# Altium project ESP_project.PrjPcb
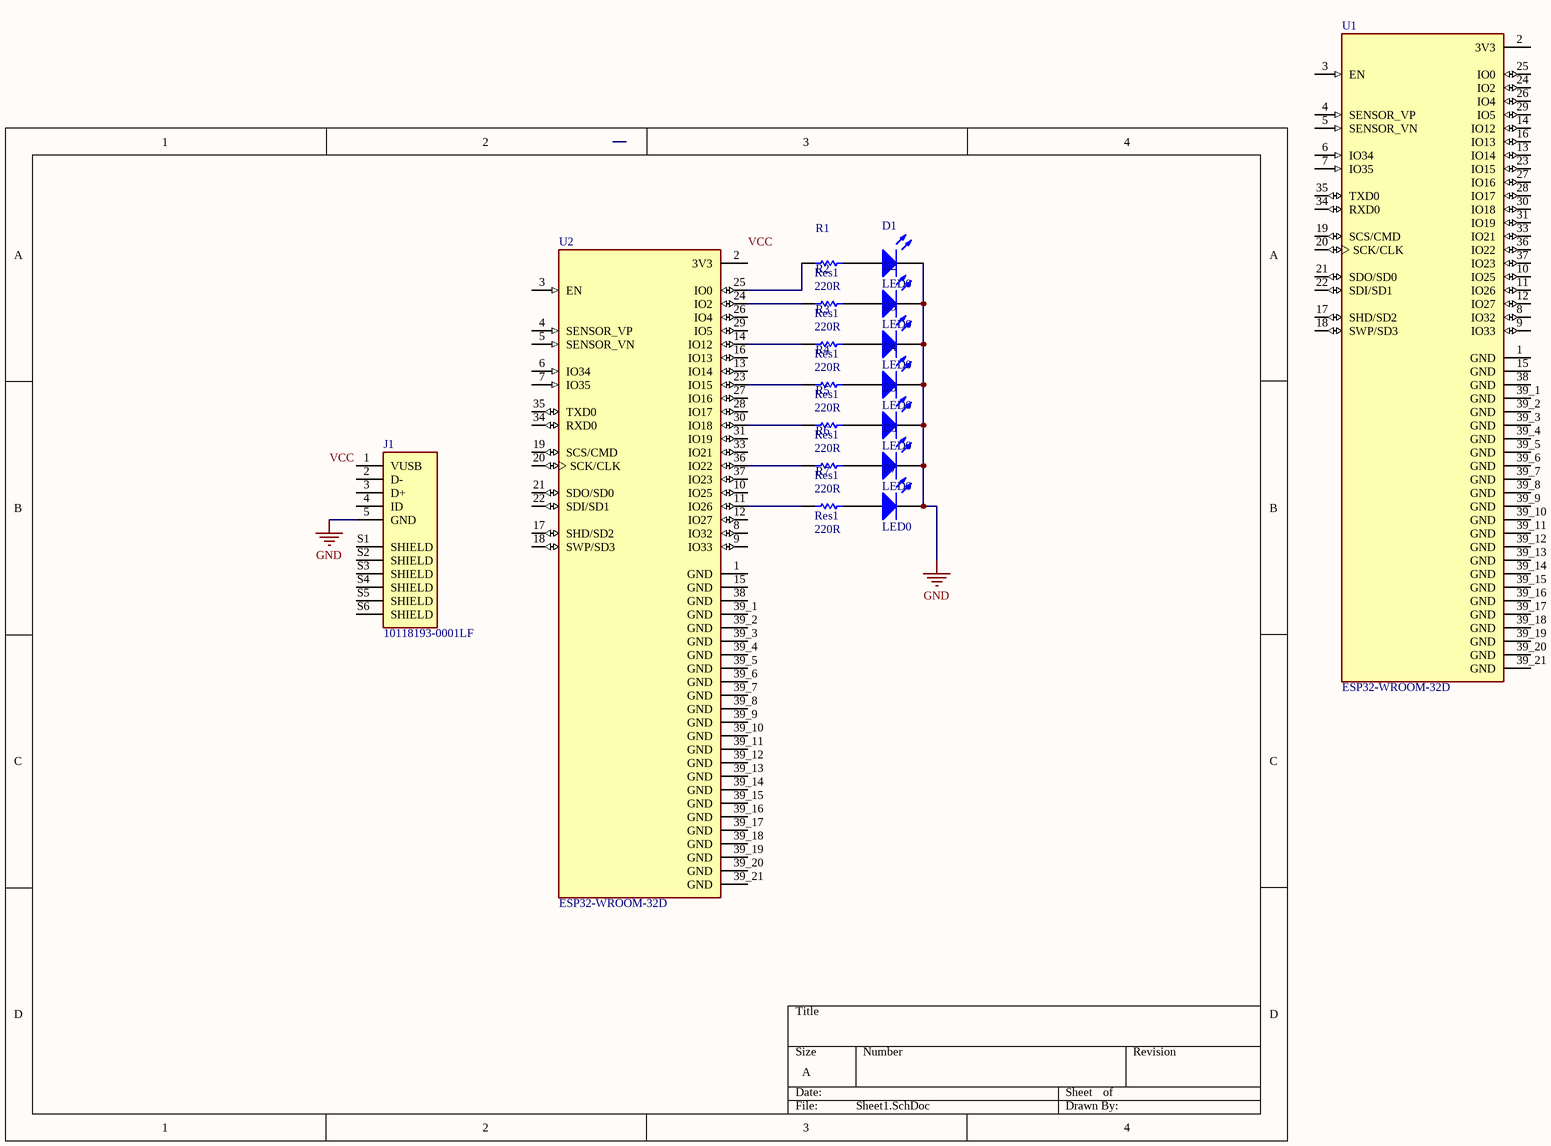
[diagram p0: Sheet1.SchDoc]
1 sheet, 17 parts. Net scope: global (net labels, ports and power ports of the same name join across sheets).
Board file: PCB1.PcbDoc

## Sheet Sheet1.SchDoc
size A; SheetNumber: 1; SheetTotal: 1; SPICEModelCacheBTZOOMSF: <root> / <DocumentId>BTZOOMSF</DocumentId> / <CacheFrame Number="0"> / <Model Name="led0" Kind="MDL"> / <Text>*Typ INFRARED GaAs LED: Vf=1.2V Vr=5V If=40mA trr=3uS / *LED Pinout: 1=A, 2=K / .MODEL LED0 D (IS=93.5P RS=84M N=2.63 BV=5 IBV=10U / + CJO=2.97P VJ=.75 M=.333 TT=4.32U)</Text> / </Model> / </CacheFrame> / </root>

### Parts
D1  LED0  [LED-0]
D2  LED0  [LED-0]
D3  LED0  [LED-0]
D4  LED0  [LED-0]
D5  LED0  [LED-0]
D6  LED0  [LED-0]
D7  LED0  [LED-0]
J1  10118193-0001LF  [AMPHENOL_10118193-0001LF]
R1  Res1  value 220R  [AXIAL-0.3]
R2  Res1  value 220R  [AXIAL-0.3]
R3  Res1  value 220R  [AXIAL-0.3]
R4  Res1  value 220R  [AXIAL-0.3]
R5  Res1  value 220R  [AXIAL-0.3]
R6  Res1  value 220R  [AXIAL-0.3]
R7  Res1  value 220R  [AXIAL-0.3]
U1  ESP32-WROOM-32D  [MODULE_ESP32-WROOM-32D]
U2  ESP32-WROOM-32D  [MODULE_ESP32-WROOM-32D]

### Nets
GND: D1.2(K) D2.2(K) D3.2(K) D4.2(K) D5.2(K) D6.2(K) D7.2(K) J1.5(GND)
NetD1_1: D1.1(A) R1.2
NetD2_1: D2.1(A) R2.2
NetD3_1: D3.1(A) R3.2
NetD4_1: D4.1(A) R4.2
NetD5_1: D5.1(A) R5.2
NetD6_1: D6.1(A) R6.2
NetD7_1: D7.1(A) R7.2
NetR1_1: R1.1 U2.25(IO0)
NetR2_1: R2.1 U2.24(IO2)
NetR3_1: R3.1 U2.14(IO12)
NetR4_1: R4.1 U2.23(IO15)
NetR5_1: R5.1 U2.30(IO18)
NetR6_1: R6.1 U2.36(IO22)
NetR7_1: R7.1 U2.11(IO26)

Not connected (* = marked no-connect by the designer): J1 1(VUSB) 2(D-) 3(D+) 4(ID) S1(SHIELD) S2(SHIELD) S3(SHIELD) S4(SHIELD) S5(SHIELD) S6(SHIELD); U1 1(GND) 2(3V3) 3(EN) 4(SENSOR_VP) 5(SENSOR_VN) 6(IO34) 7(IO35) 8(IO32) 9(IO33) 10(IO25) 11(IO26) 12(IO27) 13(IO14) 14(IO12) 15(GND) 16(IO13) 17(SHD/SD2) 18(SWP/SD3) 19(SCS/CMD) 20(SCK/CLK) 21(SDO/SD0) 22(SDI/SD1) 23(IO15) 24(IO2) 25(IO0) 26(IO4) 27(IO16) 28(IO17) 29(IO5) 30(IO18) 31(IO19) 33(IO21) 34(RXD0) 35(TXD0) 36(IO22) 37(IO23) 38(GND) 39_1(GND) 39_2(GND) 39_3(GND) 39_4(GND) 39_5(GND) 39_6(GND) 39_7(GND) 39_8(GND) 39_9(GND) 39_10(GND) 39_11(GND) 39_12(GND) 39_13(GND) 39_14(GND) 39_15(GND) 39_16(GND) 39_17(GND) 39_18(GND) 39_19(GND) 39_20(GND) 39_21(GND); U2 1(GND) 2(3V3) 3(EN) 4(SENSOR_VP) 5(SENSOR_VN) 6(IO34) 7(IO35) 8(IO32) 9(IO33) 10(IO25) 12(IO27) 13(IO14) 15(GND) 16(IO13) 17(SHD/SD2) 18(SWP/SD3) 19(SCS/CMD) 20(SCK/CLK) 21(SDO/SD0) 22(SDI/SD1) 26(IO4) 27(IO16) 28(IO17) 29(IO5) 31(IO19) 33(IO21) 34(RXD0) 35(TXD0) 37(IO23) 38(GND) 39_1(GND) 39_2(GND) 39_3(GND) 39_4(GND) 39_5(GND) 39_6(GND) 39_7(GND) 39_8(GND) 39_9(GND) 39_10(GND) 39_11(GND) 39_12(GND) 39_13(GND) 39_14(GND) 39_15(GND) 39_16(GND) 39_17(GND) 39_18(GND) 39_19(GND) 39_20(GND) 39_21(GND)

### Notes on the sheet
- Labels drawn without touching a wire or pin: VCC

### Library data of the parts
D1-D7 = LED0: Typical INFRARED GaAs LED; Published: 8-Jun-2000; LatestRevisionDate: 08-Jul-2005; LatestRevisionNote: Mech Layer 1 removed.; PackageReference: LED-0; Publisher: Altium Limited; PackageDescription: LED; 2 Leads
J1 = 10118193-0001LF: Micro USB 2.0, Input Output Connectors, B TYPE RECEPTACLE; MF: Amphenol ICC; Value: *; MP: 10118193-0001LF; Package: None; Check_prices: https://www.snapeda.com/parts/10118193-0001LF/Amphenol+FCI/view-part/?ref=eda; Purchase-URL: https://pricing.snapeda.com/search/part/10118193-0001LF/?ref=eda; Price: None; Availability: In Stock; SnapEDA_Link: https://www.snapeda.com/parts/10118193-0001LF/Amphenol+FCI/view-part/?ref=snap
R1-R7 = Res1: Resistor; Published: 8-Jun-2000; LatestRevisionDate: 17-Jul-2002; LatestRevisionNote: Re-released for DXP Platform.; PackageReference: AXIAL-0.3; Publisher: Altium Limited; PackageDescription: Axial Device, Thru-Hole; 2 Leads; 0.3 in Pin Spacing
U1 U2 = ESP32-WROOM-32D: Bluetooth, WiFi 802.11b/g/n, Bluetooth v4.2 +EDR, Class 1, 2 and 3 Transceiver Module 2.4GHz ~ 2.5GHz Integrated; MF: Espressif Systems; Price: None; Availability: In Stock; Package: Module Espressif Systems; MP: ESP32-WROOM-32D; Value: *; SnapEDA_Link: https://www.snapeda.com/parts/ESP32-WROOM-32D/Espressif+Systems/view-part/?ref=snap; Purchase-URL: https://pricing.snapeda.com/search/part/ESP32-WROOM-32D/?ref=eda; Check_prices: https://www.snapeda.com/parts/ESP32-WROOM-32D/Espressif+Systems/view-part/?ref=eda